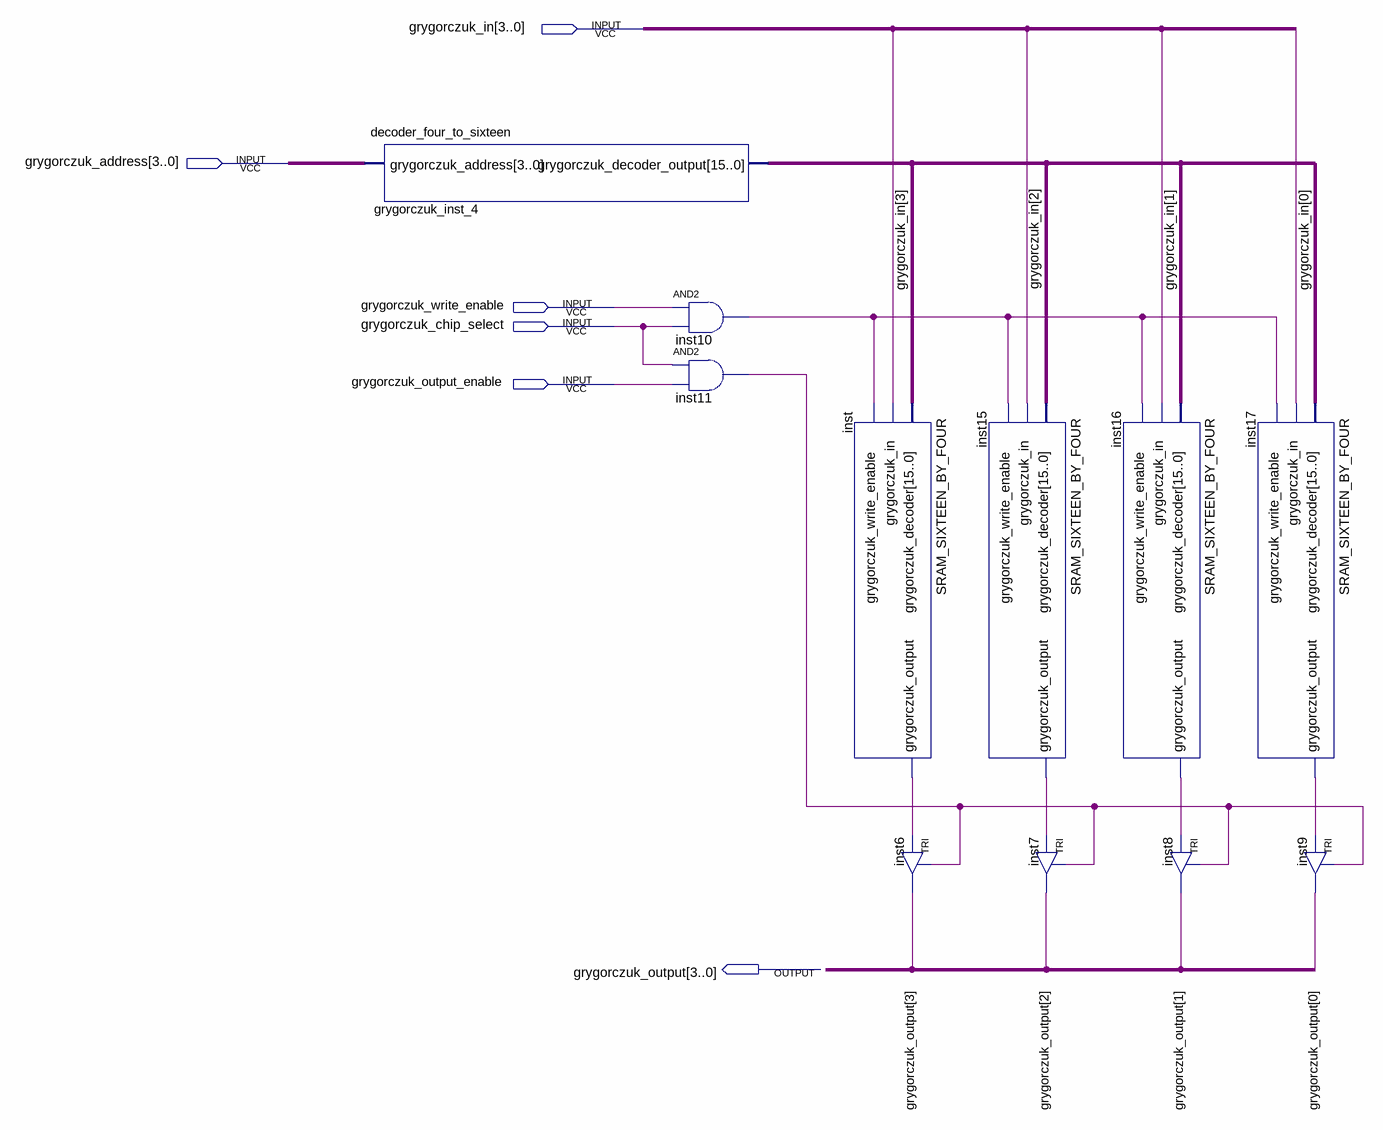
[diagram p0: schematic sheet]
// Quartus schematic SRAM_SIXTEEN_BY_FOUR_OPERATIONAL.bdf as structural Verilog: 11 symbols, 6 pins
module SRAM_SIXTEEN_BY_FOUR_OPERATIONAL (
  input  [3:0] grygorczuk_in,
  input  [3:0] grygorczuk_address,
  input  grygorczuk_write_enable,
  input  grygorczuk_chip_select,
  input  grygorczuk_output_enable,
  output [3:0] grygorczuk_output
);

  wire inst10_out, inst11_out, inst15_grygorczuk_output, inst16_grygorczuk_output, inst17_grygorczuk_output,
       inst_grygorczuk_output;
  wire [15:0] grygorczuk_inst_4_grygorczuk_decoder_output;

  decoder_four_to_sixteen grygorczuk_inst_4 (
    .grygorczuk_address(grygorczuk_address),
    .grygorczuk_decoder_output(grygorczuk_inst_4_grygorczuk_decoder_output));
  and inst10 (inst10_out, grygorczuk_write_enable, grygorczuk_chip_select);
  and inst11 (inst11_out, grygorczuk_chip_select, grygorczuk_output_enable);
  SRAM_SIXTEEN_BY_FOUR inst (
    .grygorczuk_decoder(grygorczuk_inst_4_grygorczuk_decoder_output), .grygorczuk_in(grygorczuk_in[3]),
    .grygorczuk_write_enable(inst10_out), .grygorczuk_output(inst_grygorczuk_output));
  TRI inst6 (.IN(inst_grygorczuk_output), .OE(inst11_out), .OUT(grygorczuk_output[3]));
  SRAM_SIXTEEN_BY_FOUR inst15 (
    .grygorczuk_decoder(grygorczuk_inst_4_grygorczuk_decoder_output), .grygorczuk_in(grygorczuk_in[2]),
    .grygorczuk_write_enable(inst10_out), .grygorczuk_output(inst15_grygorczuk_output));
  TRI inst7 (.IN(inst15_grygorczuk_output), .OE(inst11_out), .OUT(grygorczuk_output[2]));
  SRAM_SIXTEEN_BY_FOUR inst16 (
    .grygorczuk_decoder(grygorczuk_inst_4_grygorczuk_decoder_output), .grygorczuk_in(grygorczuk_in[1]),
    .grygorczuk_write_enable(inst10_out), .grygorczuk_output(inst16_grygorczuk_output));
  TRI inst8 (.IN(inst16_grygorczuk_output), .OE(inst11_out), .OUT(grygorczuk_output[1]));
  SRAM_SIXTEEN_BY_FOUR inst17 (
    .grygorczuk_decoder(grygorczuk_inst_4_grygorczuk_decoder_output), .grygorczuk_in(grygorczuk_in[0]),
    .grygorczuk_write_enable(inst10_out), .grygorczuk_output(inst17_grygorczuk_output));
  TRI inst9 (.IN(inst17_grygorczuk_output), .OE(inst11_out), .OUT(grygorczuk_output[0]));
endmodule
